# Altium schematic sheet 0001_Page 1.SchDoc
size 426 x 274 mm
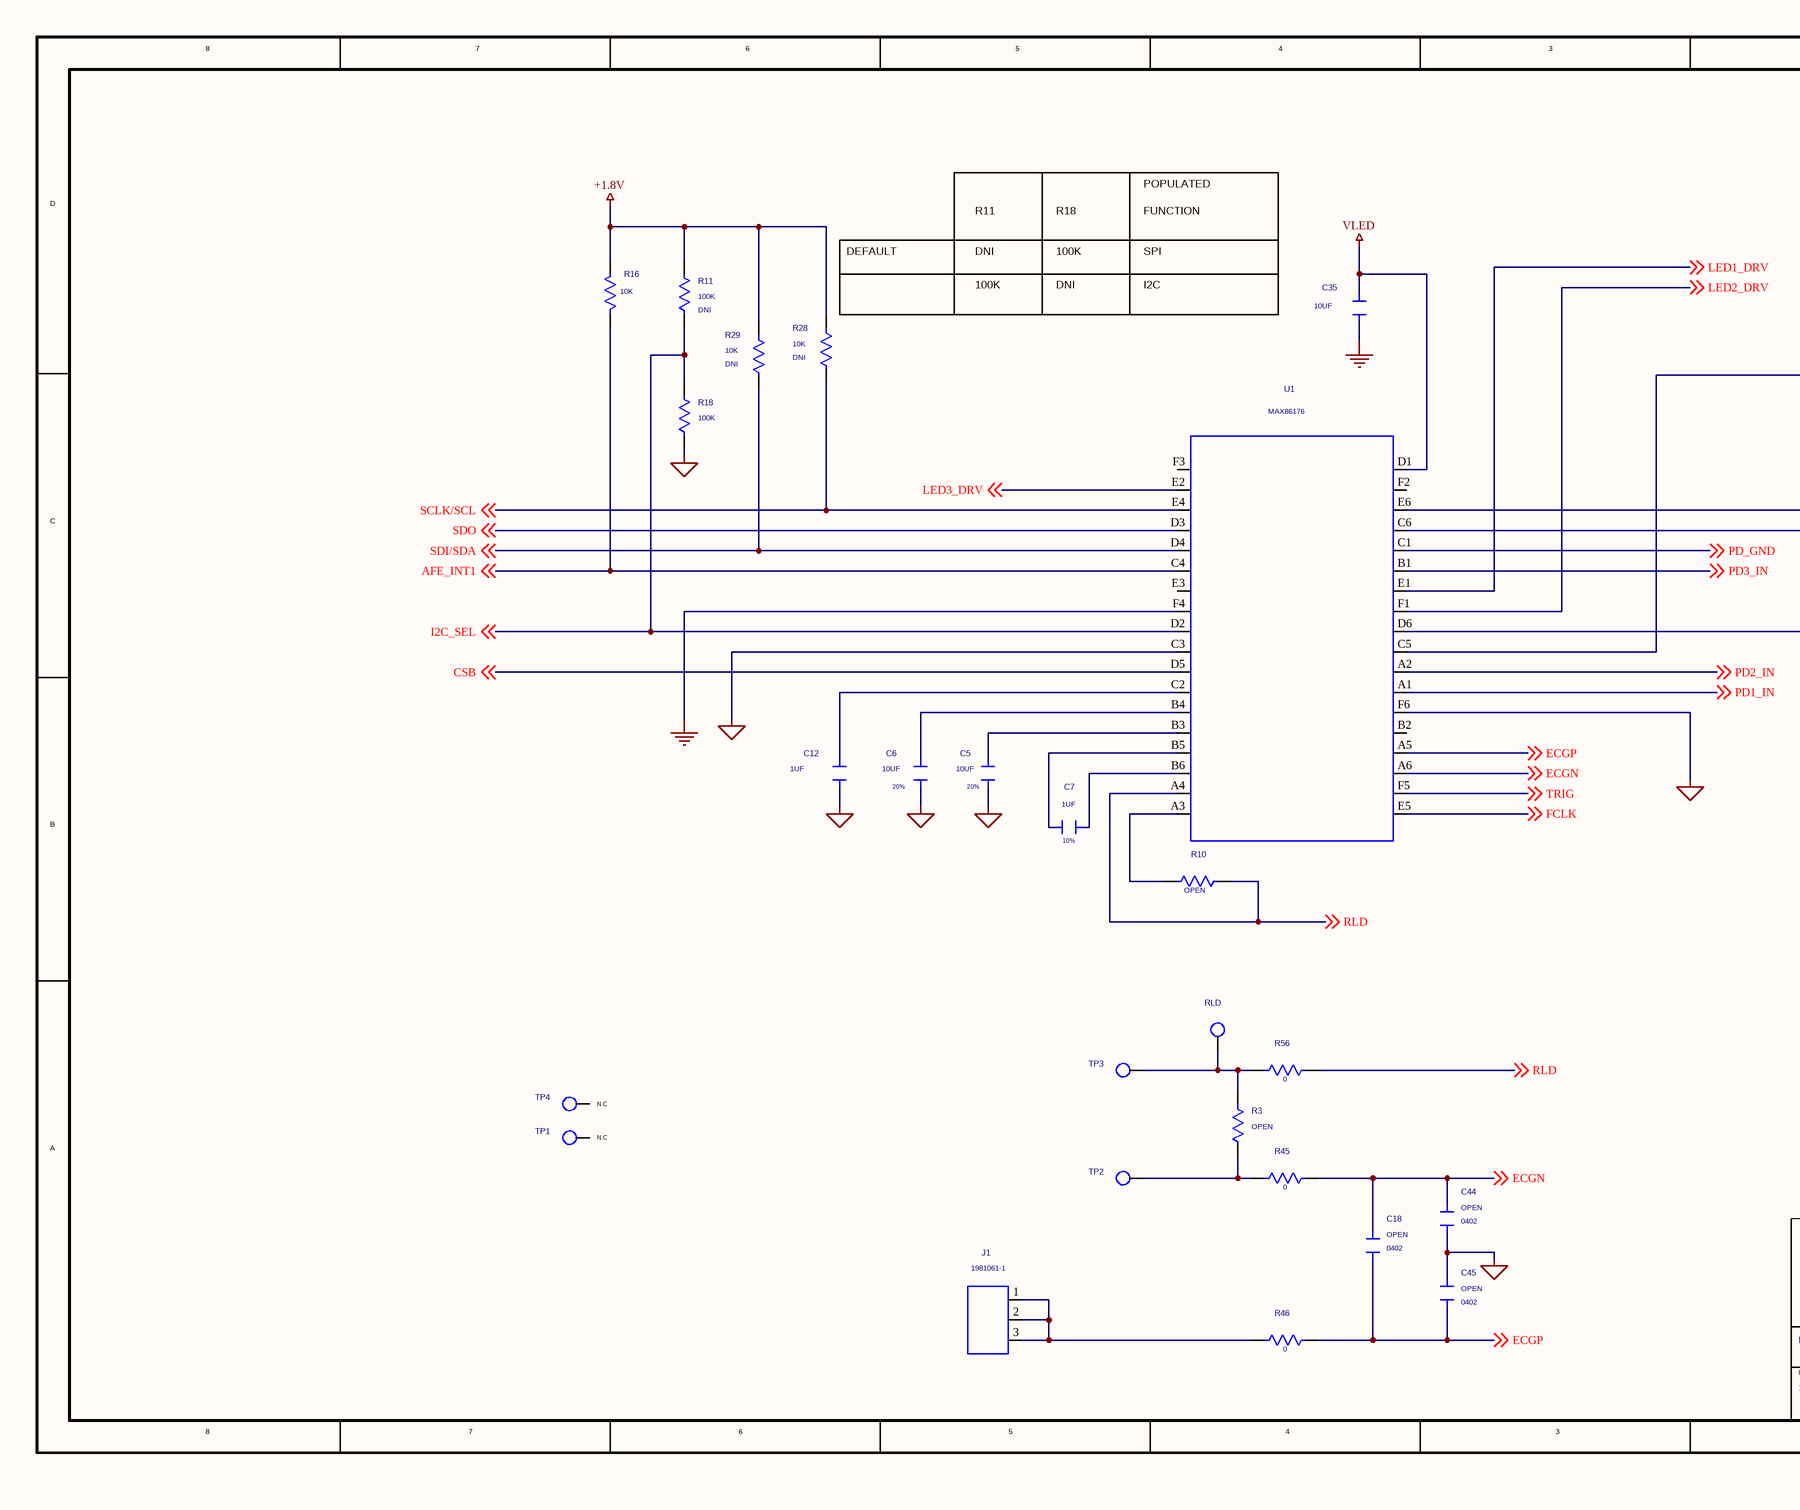
[diagram p0: 0001_Page 1.SchDoc, left]
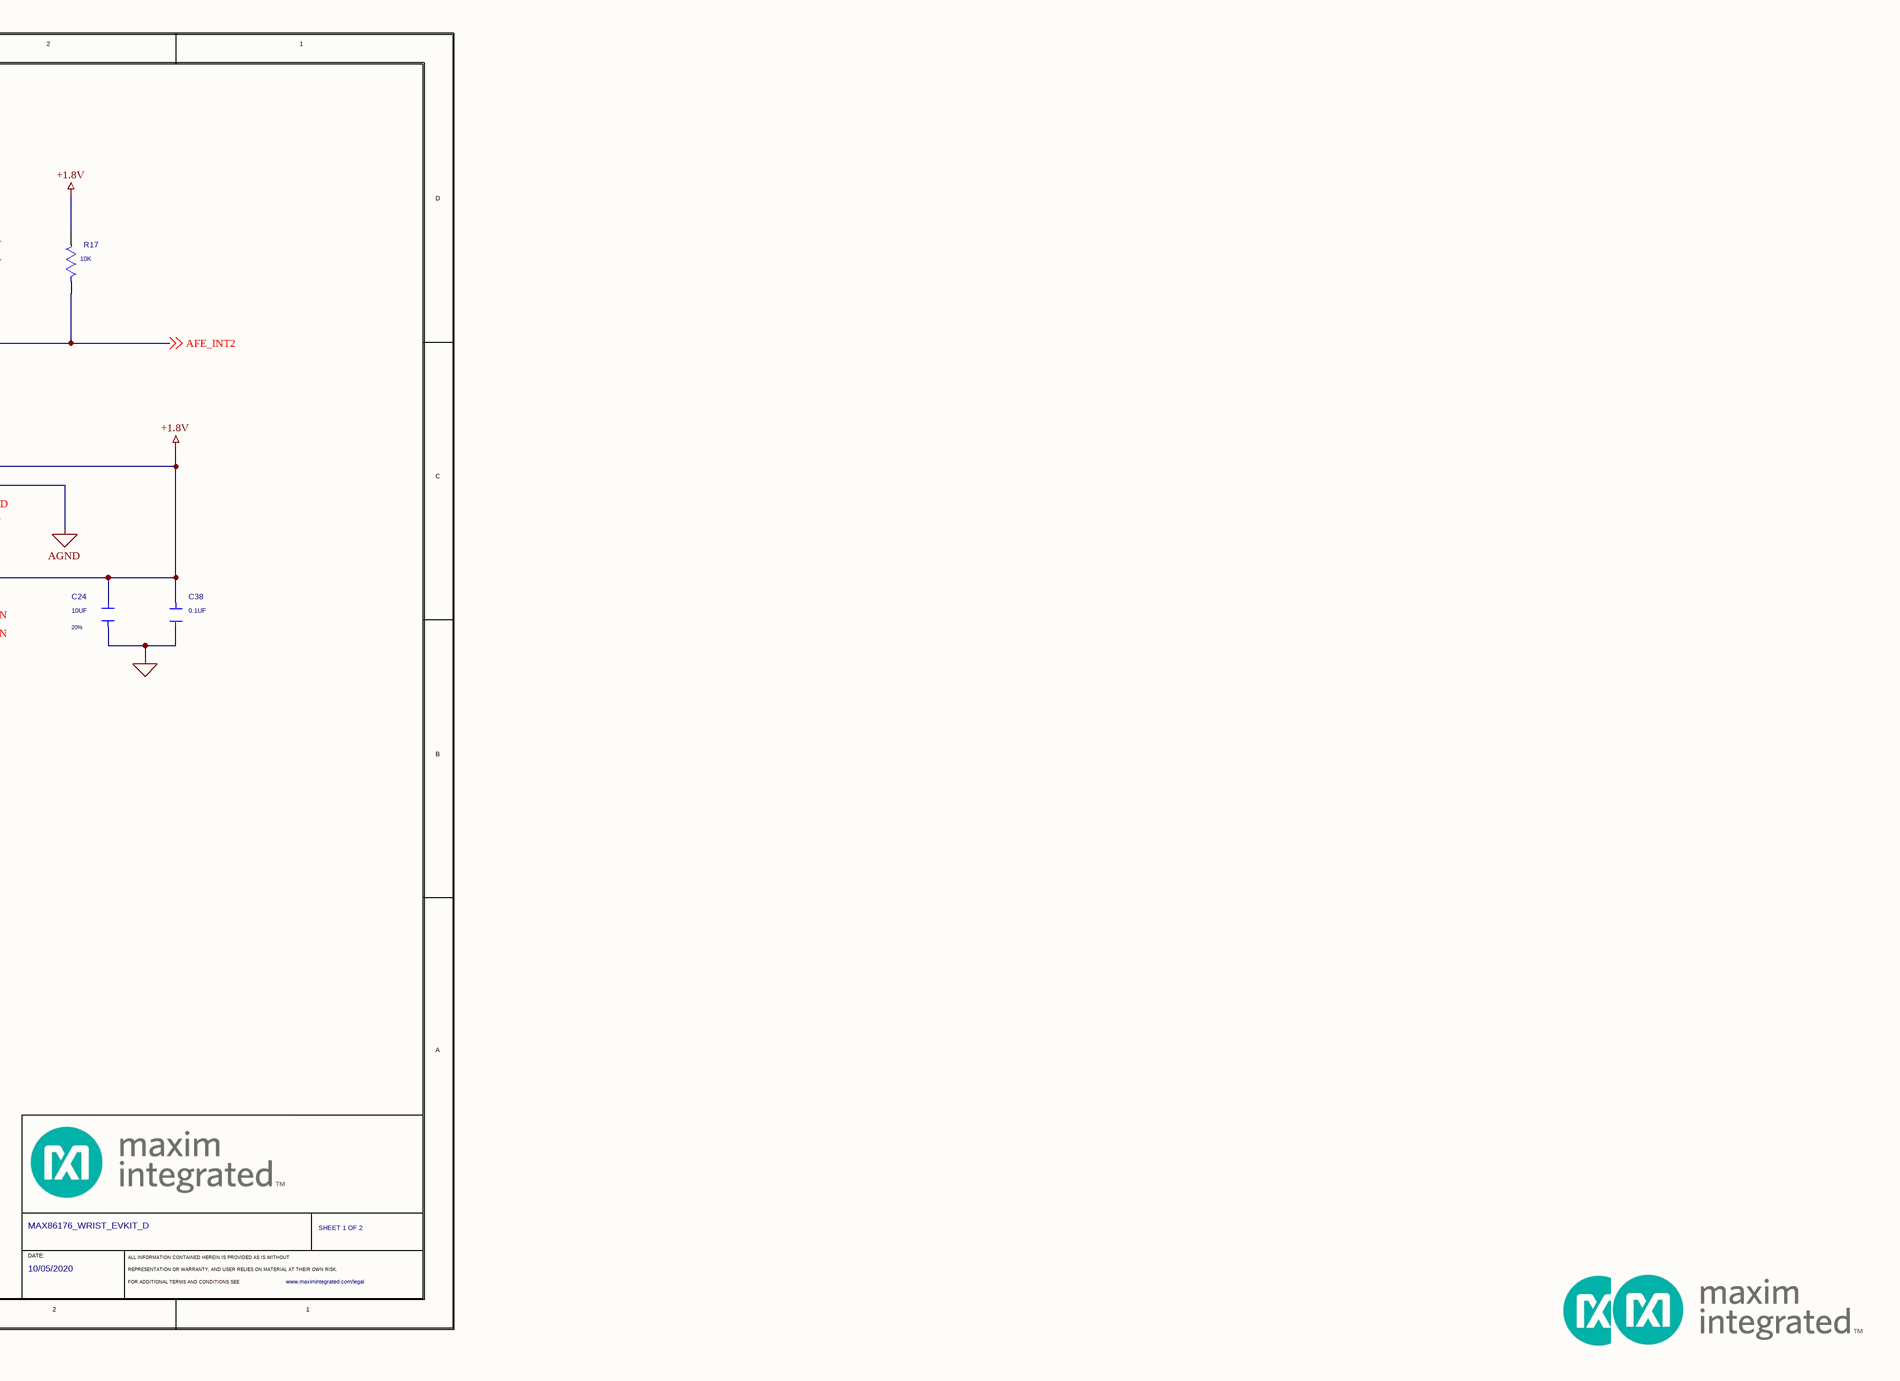
[diagram p1: 0001_Page 1.SchDoc, right]

## Parts
*  CUSTOM_TXT_CDS21: SHEET 1 OF 2  PROJECT_TITLE: MAX86176_WRIST_EVKIT_D  DATE: 10/05/2020  (hidden comment: MAXIM_B_SIZE_CF)  (graphical)
C5  10UF  TOLERANCE: 20%  [0402]
C6  10UF  TOLERANCE: 20%  [0402]
C7  1UF  TOLERANCE: 10%  [0603]
C12  1UF  [0402]
C18  OPEN  [0402]
C24  10UF  TOLERANCE: 20%  [0603]
C35  10UF  [0603]
C38  0.1UF  [0603]
C44  OPEN  [0402]
C45  OPEN  [0402]
J1  1981061-1  [TECO_1981061-1]
R3  OPEN  [RESC0603X33M]
R10  OPEN  [0402]
R11  100K  VARIANT: DNI  [0402]
R16  10K  [0402]
R17  10K  [0402]
R18  100K  [0402]
R28  10K  VARIANT: DNI  [0402]
R29  10K  VARIANT: DNI  [0402]
R45  0  [0402]
R46  0  [0402]
R56  0  [0402]
RLD  N/A  [TP_C25H12]  (value not drawn)
TP1  N/A  [TP_S_SQUARE_3-50]  (value not drawn)
TP2  N/A  [TP_S_SQUARE_3-50]  (value not drawn)
TP3  N/A  [TP_S_SQUARE_3-50]  (value not drawn)
TP4  N/A  [TP_S_SQUARE_3-50]  (value not drawn)
U1  MAX86176  [MAXIM_21-100413]

## Nets
+1.8V: C24.2 C38.2 R11.2 R16.2 R17.2 R28.1 R29.1 U1.D6 U1.E6
AGND: C5.1 C6.1 C12.1 C24.1 C38.1 C44.1 C45.2 R18.1 U1.C3 U1.C6 U1.F6
PGND: C35.1 U1.F4
VLED: C35.2 U1.D1
AFE_INT1: R16.1 U1.C4 ; off-sheet AFE_INT1
AFE_INT2: R17.1 U1.C5 ; off-sheet AFE_INT2
CSB: U1.D5 ; off-sheet CSB
ECGN: C18.2 C44.2 R45.2 U1.A6 ; off-sheet ECGN
ECGP: C18.1 C45.1 R46.2 U1.A5 ; off-sheet ECGP
FCLK: U1.E5 ; off-sheet FCLK
I2C_SEL: R11.1 R18.2 U1.D2 ; off-sheet I2C_SEL
LED1_DRV: U1.E1 ; off-sheet LED1_DRV
LED2_DRV: U1.F1 ; off-sheet LED2_DRV
LED3_DRV: U1.E2 ; off-sheet LED3_DRV
PD1_IN: U1.A1(A1_1) ; off-sheet PD1_IN
PD2_IN: U1.A2 ; off-sheet PD2_IN
PD3_IN: U1.B1 ; off-sheet PD3_IN
PD_GND: U1.C1 ; off-sheet PD_GND
RLD: R10.2 R56.2 U1.A4 ; off-sheet RLD
SCLK/SCL: R28.2 U1.E4 ; off-sheet SCLK/SCL
SDI/SDA: R29.2 U1.D4 ; off-sheet SDI/SDA
SDO: U1.D3 ; off-sheet SDO
TRIG: U1.F5 ; off-sheet TRIG
NetC5_2: C5.2 U1.B3
NetC6_2: C6.2 U1.B4
NetC7_1: C7.1 U1.B6
NetC7_2: C7.2 U1.B5
NetC12_2: C12.2 U1.C2
NetJ1_1: J1.1 J1.2 J1.3 R46.1
NetR3_1: R3.1 R56.1 RLD.1(TP1) TP3.1(TP1)
NetR3_2: R3.2 R45.1 TP2.1(TP1)
NetR10_1: R10.1 U1.A3

Not connected (* = marked no-connect by the designer): TP1 1(TP1); TP4 1(TP1); U1 B2 E3 F2 F3

## Notes on the sheet
- R11
- R18
- POPULATED
- FUNCTION
- DEFAULT
- 100K
- DNI
- SPI
- I2C
- (near TP4) N.C
- (near TP1) N.C
- (in symbol MAXIM_B_SIZE_CF) 8; 7; 6; 5; 4; 3; 2; D; C; B; A; DATE:; ALL INFORMATION CONTAINED HEREIN IS PROVIDED AS IS WITHOUT; REPRESENTATION OR WARRANTY, AND USER RELIES ON MATERIAL AT THEIR OWN RISK.; FOR ADDITIONAL TERMS AND CONDITIONS SEE

## Library data of the parts
* = MAXIM_B_SIZE_CF: OriginalSymbolOrigin: (175,5230); COMMENT_BODY: TRUE; Page Number: 1; CURRENT_DESIGN_SHEET: Page 1; LEAGAL_WEBLINK: www.maximintegrated.com/legal; WEBLINK1: www.maximintegrated.com
C5 C6 = CAP_NP#1: CAP; SMT (0402); 10UF; 20%; 10V; X5R; CERAMIC; MFG_PART_NUMBER: GRM155R61A106ME44;GRM155R61A106ME11;0402ZD106MAT2A;CL05A106MP5NUNC; MANUFACTURER: MURATA;MURATA;AVX;SAMSUNG; OriginalSymbolOrigin: (-50,50); PACK_TYPE: 0402CAP; MAXINV: 20-0010U-BA12; CAP: 1.00E-05; DRAWING: @MAX86176_WRIST_EVKIT_D.MAX86176_WRIST_EVKIT_D(SCH_1):PAGE1; PHYS_PAGE: 1; TEMP_RANGE: -55 DEGC TO +85 DEGC; MATERIAL_TYPE: CERAMIC CHIP; VLOG_PARAM01: CAP:INTEGER; PCB Footprint_CDS: 0402; CASE: SMT (0402); REFLOW: -; VER: 1; VOLTAGE_RATING: 10V
C7 = CAP_NP#1: CAP; SMT (0603); 1UF; 10%; 25V; X7R; CERAMIC; MFG_PART_NUMBER: GRM188R71E105KA12;CGA3E1X7R1E105K;TMK107B7105KA;06033C105KAT2A;GCM188R71E105KA64;C1608X7R1E105K080AE;CGA3E1X7R1E105K080AC; MANUFACTURER: MURATA;TAIYO YUDEN;AVX;TAIYO YUDEN; OriginalSymbolOrigin: (-50,50); PACK_TYPE: 0603CAP; MAXINV: 20-0001U-P6; CAP: 1.00E-06; DRAWING: @MAX86176_WRIST_EVKIT_D.MAX86176_WRIST_EVKIT_D(SCH_1):PAGE1; PHYS_PAGE: 1; TEMP_RANGE: -55 DEGC TO +125 DEGC; VLOG_PARAM01: CAP:INTEGER; MATERIAL_TYPE: CERAMIC CHIP; PCB Footprint_CDS: 0603; CASE: SMT (0603); REFLOW: -; VER: 1; VOLTAGE_RATING: 25V
C12 = CAP_NP: CAP; SMT (0402); 1UF; 10%; 16V; X5R; CERAMIC; MFG_PART_NUMBER: CL05A105KO5NNN; MANUFACTURER: SAMSUNG; OriginalSymbolOrigin: (-50,50); PACK_TYPE: 0402CAP; MAXINV: EC2430; CAP: 1.00E-06; DRAWING: @MAX86176_WRIST_EVKIT_D.MAX86176_WRIST_EVKIT_D(SCH_1):PAGE1; PHYS_PAGE: 1; VER: 2; TEMP_RANGE: -55 DEGC TO +85 DEGC; VLOG_PARAM01: CAP:INTEGER; MATERIAL_TYPE: CERAMIC CHIP; PCB Footprint_CDS: 0402; CASE: SMT (0402); REFLOW: -; TOLERANCE: 10%; VOLTAGE_RATING: 16V
C18 C44 C45 = EVK_GENERIC_CAPACITORS: PACKAGE OUTLINE 0402 NON-POLAR CAPACITOR - EVKIT; OriginalSymbolOrigin: (-50,50); PACK_TYPE: 0402CAP; DRAWING: @MAX86176_WRIST_EVKIT_D.MAX86176_WRIST_EVKIT_D(SCH_1):PAGE1; PHYS_PAGE: 1; MAXINV: N/A; PCB Footprint_CDS: 0402; CASE: N/A; MFG_PART_NUMBER: N/A; TOLERANCE: N/A; VER: 1; VOLTAGE_RATING: N/A; MANUFACTURER: N/A; TEMP_RANGE: N/A; MATERIAL_TYPE: N/A
C24 = EK_CAP_NP#1: CAP; SMT (0603); 10UF; 20%; 25V; X5R; CERAMIC CHIP; MFG_PART_NUMBER: GRM188R61E106MA73; MANUFACTURER: MURATA; OriginalSymbolOrigin: (-50,50); MAXINV: 20-0010U-P7; CAP: 1.00E-05; DRAWING: @MAX86176_WRIST_EVKIT_D.MAX86176_WRIST_EVKIT_D(SCH_1):PAGE1; PHYS_PAGE: 1; TEMP_RANGE: -55 DEGC TO +85 DEGC; VLOG_PARAM01: CAP:INTEGER; PACK_TYPE: 0603; PCB Footprint_CDS: 0603; CASE: SMT (0603); REFLOW: -; VER: 1; VOLTAGE_RATING: 25V; MATERIAL_TYPE: CERAMIC CHIP
C35 = EK_CAP_NP: CAP; SMT (0603); 10UF; 20%; 25V; X5R; CERAMIC CHIP; MFG_PART_NUMBER: GRM188R61E106MA73; MANUFACTURER: MURATA; OriginalSymbolOrigin: (-50,50); MAXINV: 20-0010U-P7; CAP: 1.00E-05; DRAWING: @MAX86176_WRIST_EVKIT_D.MAX86176_WRIST_EVKIT_D(SCH_1):PAGE1; PHYS_PAGE: 1; VER: 2; TEMP_RANGE: -55 DEGC TO +85 DEGC; VLOG_PARAM01: CAP:INTEGER; PACK_TYPE: 0603; PCB Footprint_CDS: 0603; CASE: SMT (0603); REFLOW: -; TOLERANCE: 20%; VOLTAGE_RATING: 25V; MATERIAL_TYPE: CERAMIC CHIP
C38 = CAP_NP: CAP; SMT (0603); 0.1UF; 10%; 100V; X7R; CERAMIC; MFG_PART_NUMBER: GRM188R72A104KA35; CC0603KRX7R0BB104; MANUFACTURER: YAGEO;MURATA;TAIYO YUDEN;AVX;MURATA; OriginalSymbolOrigin: (-50,50); PACK_TYPE: 0603CAP; MAXINV: 20-000U1-01; CAP: 1.00E-07; DRAWING: @MAX86176_WRIST_EVKIT_D.MAX86176_WRIST_EVKIT_D(SCH_1):PAGE1; PHYS_PAGE: 1; VER: 2; TEMP_RANGE: -55 DEGC TO +125 DEGC; VLOG_PARAM01: CAP:INTEGER; PCB Footprint_CDS: 0603; REFLOW: -; TOLERANCE: 10%; VOLTAGE_RATING: 100V
J1 = 1981061-1: CONNECTOR; MALE; SMD; LEAF TYPE BATTERY CONNECTOR; WITHOUT BOSS; 3 PINS; MANUFACTURER: TYCO; OriginalSymbolOrigin: (-75,125); MAXINV: EH111000003993; DRAWING: @MAX86176_WRIST_EVKIT_D.MAX86176_WRIST_EVKIT_D(SCH_1):PAGE1; PHYS_PAGE: 1; PACK_TYPE: SMD; PCB Footprint_CDS: TECO_1981061-1; MFG_PART_NUMBER: 1981061-1; REFLOW: -; TOLERANCE: N/A; VER: 1; VOLTAGE_RATING: N/A; TEMP_RANGE: N/A
R3 = EVK_GENERIC_RESISTORS#1: PACKAGE OUTLINE 0201 RESISTOR - EVKIT; OriginalSymbolOrigin: (-50,75); DRAWING: @MAX86176_WRIST_EVKIT_D.MAX86176_WRIST_EVKIT_D(SCH_1):PAGE1; PHYS_PAGE: 1; VER: 4; PACK_TYPE: 0201RES; MAXINV: N/A; PCB Footprint_CDS: RESC0603X33M; CASE: SMT (0201); MFG_PART_NUMBER: N/A; POWER_RATING: N/A; TOLERANCE: N/A; VOLTAGE_RATING: N/A; MANUFACTURER: N/A; TEMP_RANGE: N/A; MATERIAL_TYPE: N/A
R10 = EVK_GENERIC_RESISTORS: PACKAGE OUTLINE 0402 RESISTOR - EVKIT; OriginalSymbolOrigin: (-75,50); DRAWING: @MAX86176_WRIST_EVKIT_D.MAX86176_WRIST_EVKIT_D(SCH_1):PAGE1; PHYS_PAGE: 1; VER: 2; PACK_TYPE: 0402RES; MAXINV: N/A; PCB Footprint_CDS: 0402; CASE: SMT (0402); MFG_PART_NUMBER: N/A; POWER_RATING: N/A; TOLERANCE: N/A; VOLTAGE_RATING: N/A; MANUFACTURER: N/A; TEMP_RANGE: N/A; MATERIAL_TYPE: N/A
R11 = RES_SMD#1: RES; SMT (0402); 100K; 1%; +/-100PPM/DEGC; 0.1000W; MFG_PART_NUMBER: ERJ-2RKF1003; MANUFACTURER: PANASONIC; OriginalSymbolOrigin: (-75,50); PACK_TYPE: 0402RES; MAXINV: 80-0100K-18; DRAWING: @MAX86176_WRIST_EVKIT_D.MAX86176_WRIST_EVKIT_D(SCH_1):PAGE1; PHYS_PAGE: 1; POWER_RATING: 0.10W; RES: 1.00E05; VER: 2; TEMP_RANGE: -55 DEGC TO +155 DEGC; VLOG_PARAM01: RES:INTEGER; MATERIAL_TYPE: THICK FILM; PCB Footprint_CDS: 0402; CASE: SMT (0402); REFLOW: -; TOLERANCE: 1%
R16 R17 R28 R29 = RES_SMD: RES; SMT (0402); 10K; 1%; +/-100PPM/DEGC; 0.1000W; MFG_PART_NUMBER: ERJ-2RKF1002; MANUFACTURER: PANASONIC; OriginalSymbolOrigin: (-50,75); PACK_TYPE: 0402RES; MAXINV: 80-0010K-18; DRAWING: @MAX86176_WRIST_EVKIT_D.MAX86176_WRIST_EVKIT_D(SCH_1):PAGE1; PHYS_PAGE: 1; POWER_RATING: 0.10W; RES: 1.00E04; VER: 4; TEMP_RANGE: -55 DEGC TO +155 DEGC; VLOG_PARAM01: RES:INTEGER; MATERIAL_TYPE: THICK FILM; PCB Footprint_CDS: 0402; CASE: SMT (0402); REFLOW: -; TOLERANCE: 1%
R18 = RES_SMD#1: RES; SMT (0402); 100K; 1%; +/-100PPM/DEGC; 0.1000W; MFG_PART_NUMBER: ERJ-2RKF1003; MANUFACTURER: PANASONIC; OriginalSymbolOrigin: (-75,50); PACK_TYPE: 0402RES; MAXINV: 80-0100K-18; DRAWING: @MAX86176_WRIST_EVKIT_D.MAX86176_WRIST_EVKIT_D(SCH_1):PAGE1; PHYS_PAGE: 1; POWER_RATING: 0.10W; RES: 1.00E05; VER: 2; TEMP_RANGE: -55 DEGC TO +155 DEGC; MATERIAL_TYPE: THICK FILM; VLOG_PARAM01: RES:INTEGER; PCB Footprint_CDS: 0402; CASE: SMT (0402); REFLOW: -; TOLERANCE: 1%
R45 R56 = RES_SMD#1: RES; SMT (0402); 0; JUMPER; JUMPER; 0.1000W; MFG_PART_NUMBER: ERJ-2GE0R00; MANUFACTURER: PANASONIC; OriginalSymbolOrigin: (-75,50); PACK_TYPE: 0402RES; MAXINV: 80-0000R-26A; DRAWING: @MAX86176_WRIST_EVKIT_D.MAX86176_WRIST_EVKIT_D(SCH_1):PAGE1; PHYS_PAGE: 1; POWER_RATING: 0.10W; RES: 0.00000001E00; TOLERANCE: 0%; VER: 2; TEMP_RANGE: -55 DEGC TO +155 DEGC; VLOG_PARAM01: RES:INTEGER; MATERIAL_TYPE: THICK FILM; PCB Footprint_CDS: 0402; CASE: SMT (0402); REFLOW: -
R46 = RES_SMD#1: RES; SMT (0402); 0; JUMPER; JUMPER; 0.1000W; MFG_PART_NUMBER: ERJ-2GE0R00; MANUFACTURER: PANASONIC; OriginalSymbolOrigin: (-75,50); PACK_TYPE: 0402RES; MAXINV: 80-0000R-26A; DRAWING: @MAX86176_WRIST_EVKIT_D.MAX86176_WRIST_EVKIT_D(SCH_1):PAGE1; PHYS_PAGE: 1; POWER_RATING: 0.10W; RES: 0.00000001E00; TOLERANCE: 0%; VER: 2; TEMP_RANGE: -55 DEGC TO +155 DEGC; MATERIAL_TYPE: THICK FILM; VLOG_PARAM01: RES:INTEGER; PCB Footprint_CDS: 0402; CASE: SMT (0402); REFLOW: -
RLD = TP: TESTPOINT WITH 12 MILS HOLE DIA, and 25 MILS PAD DIA; NOT FOR COLD TEST; OriginalSymbolOrigin: (-125,50); DRAWING: @MAX86176_WRIST_EVKIT_D.MAX86176_WRIST_EVKIT_D(SCH_1):PAGE1; PHYS_PAGE: 1; PACK_TYPE: TP; MAXINV: N/A; PCB Footprint_CDS: TP_C25H12; MFG_PART_NUMBER: N/A; PART_NAME: TP; REFLOW: -; TOLERANCE: N/A; VER: 1; VOLTAGE_RATING: N/A; MANUFACTURER: N/A; TEMP_RANGE: N/A
TP1-TP4 = TP: TESTPOINT WITH 3.50MM SQUARE PAD DIAMETER; OriginalSymbolOrigin: (-125,50); DRAWING: @MAX86176_WRIST_EVKIT_D.MAX86176_WRIST_EVKIT_D(SCH_1):PAGE1; PHYS_PAGE: 1; PACK_TYPE: TP; MAXINV: N/A; PCB Footprint_CDS: TP_S_SQUARE_3-50; MFG_PART_NUMBER: N/A; PART_NAME: TP; REFLOW: -; TOLERANCE: N/A; VER: 1; VOLTAGE_RATING: N/A; MANUFACTURER: N/A; TEMP_RANGE: N/A
U1 = EK_MAX86176: EVKIT PART - IC; MAX86176; ULTRA-LOW POWER; OPTICAL PPG AND SINGLE LEAD ECD AFE; PACKAGE OUTLINE DRAWING: 21-100413; PACKAGE CODE: N362D2+1; MANUFACTURER: MAXIM; OriginalSymbolOrigin: (-375,775); PACK_TYPE: WLP36_1; DRAWING: @MAX86176_WRIST_EVKIT_D.MAX86176_WRIST_EVKIT_D(SCH_1):PAGE1; PHYS_PAGE: 1; VER: 5; VOLTAGE_RATING: +1.7V TO +2V; TEMP_RANGE: -40 DEGC TO +85 DEGC; MAXINV: N/A; PCB Footprint_CDS: MAXIM_21-100413; MFG_PART_NUMBER: MAX86176; REFLOW: -; SEC_TYPE: WLP36_1; TOLERANCE: N/A